# Altium schematic sheet LPGDetA1_rel.SchDoc
size A4; DocumentNumber: 2; SheetNumber: 2; SheetTotal: 6; Subtitle0: Subtitle0; Subtitle1: Subtitle1; Subtitle2: Subtitle2; LotOfPieces: 1; SVNPath: SVNPath
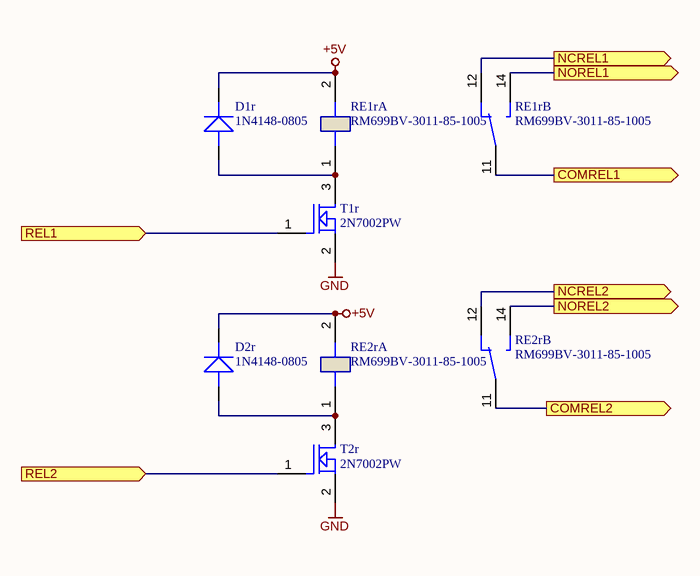
[diagram p0: LPGDetA1_rel.SchDoc]

## Parts
?  (no value)
D1r  1N4148-0805  [D0805]
D2r  1N4148-0805  [D0805]
RE1r  RM699BV-3011-85-1005  [RM699BV]  (parts A,B of 2)
RE2r  RM699BV-3011-85-1005  [RM699BV]  (parts A,B of 2)
T1r  2N7002PW  [SOT323-3_FLOW]
T2r  2N7002PW  [SOT323-3_FLOW]

## Ports
COMREL1, COMREL2, NCREL1, NCREL2, NOREL1, NOREL2, REL1, REL2

## Nets
+5V: D1r.CATH D2r.CATH RE1r.2(A2) RE2r.2(A2)
GND: T1r.2(SOURCE) T2r.2(SOURCE)
COMREL1: RE1r.11 ; port COMREL1
COMREL2: RE2r.11 ; port COMREL2
NCREL1: RE1r.12 ; port NCREL1
NCREL2: RE2r.12 ; port NCREL2
NOREL1: RE1r.14 ; port NOREL1
NOREL2: RE2r.14 ; port NOREL2
REL1: T1r.1(GATE) ; port REL1
REL2: T2r.1(GATE) ; port REL2
NetD1r_ANOD: D1r.ANOD RE1r.1(A1) T1r.3(DRAIN)
NetD2r_ANOD: D2r.ANOD RE2r.1(A1) T2r.3(DRAIN)

## Notes on the sheet
- K.A.
- echnology
- Wariant:
- Projekt i wykonanie: Miroslaw Lach MRQ, www.mrq-ml.com
- "AMPROJECT" Andrzej Maciejak
- SVNPath:
- Page:
- Rev.
- /
- File name:

## Library data of the parts
? = KATECHNOLOGYLOGO
D1r D2r = 1N4148-0805[[/\]]D0805: Descript: Small signal diode; Currency5: PLZ; Amount5: 25+; Value: 1N4148-0805; Dimensions: D0805; Supplier5: tme.pl; Reference5: 1N4148-0805; Price5: 0,084; DateOfPrice5: 2012-09-21; Price1: 0,052
RE1r RE2r = RM699BV-3011-85-1005[[/\]]28x5x15: Descript: Przekaznik miniaturowy pionowy 6A/250VAC, cewka 5VDC; Reference5: RM699V-P-05; Currency5: PLN; Amount5: 1; Value: RM699BV-3011-85-1005; Dimensions: 28x5x15; ComponentLink1Description: Datasheet; ComponentLink1URL: http://www.mrq-ml.com/Parts/Relays/rm699b.pdf; Supplier5: tme.pl; Manufacturer5: Relpol; Typ5: RM699BV-3011-85-1005; Price5: 11,1; DateOfPrice5: 2012-10-28
T1r T2r = 2N7002PW[[/\]]SOT323-3: Descript: N-channel enhacement-mode vertical DMOS FET; Reference5: 1829184; Currency5: PLN; Amount5: 1+; Value: 2N7002PW; Dimensions: SOT323-3; ComponentLink1Description: Datasheet; ComponentLink1URL: http://www.mrq-ml.com/Parts/Transistors/2N7002PW.pdf; Supplier5: farnell.com; Price5: 0,17; DateOfPrice5: 2012-09-19; Manufacturer5: NXP; Typ5: 2N7002PW; Price1: 0,14